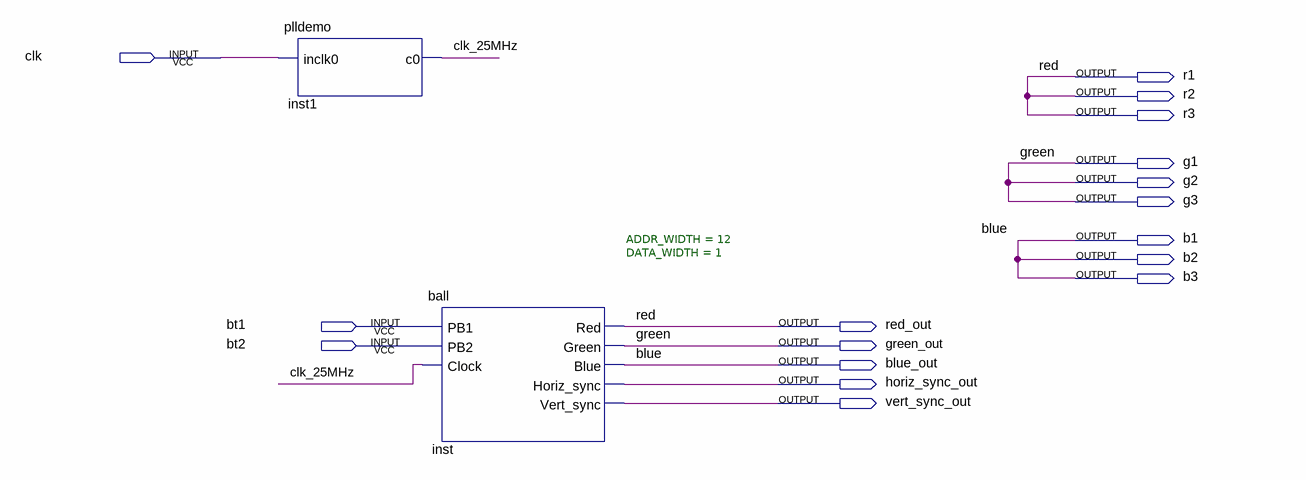
[diagram p0: schematic sheet]
// Quartus schematic ball_bounce.bdf as structural Verilog: 2 symbols, 17 pins
module ball_bounce (
  input  clk,
  input  bt1,
  input  bt2,
  output r1,
  output r2,
  output r3,
  output g1,
  output g2,
  output g3,
  output b1,
  output b2,
  output b3,
  output red_out,
  output green_out,
  output blue_out,
  output horiz_sync_out,
  output vert_sync_out
);

  wire clk_25MHz;

  plldemo inst1 (.inclk0(clk), .c0(clk_25MHz));
  ball #(.ADDR_WIDTH(12), .DATA_WIDTH(1)) inst (
    .PB1(bt1), .PB2(bt2), .Clock(clk_25MHz), .Red(r1), .Green(g1), .Blue(b1), .Horiz_sync(horiz_sync_out),
    .Vert_sync(vert_sync_out));

  assign b2 = b1;
  assign b3 = b1;
  assign blue_out = b1;
  assign g2 = g1;
  assign g3 = g1;
  assign green_out = g1;
  assign r2 = r1;
  assign r3 = r1;
  assign red_out = r1;

  // Other names for the same wires on the sheet: blue = b1; green = g1; red = r1
endmodule
